# Altium schematic sheet BFMC_PowerDiagram.SchDoc
size A; SheetNumber: 1; SheetTotal: 8
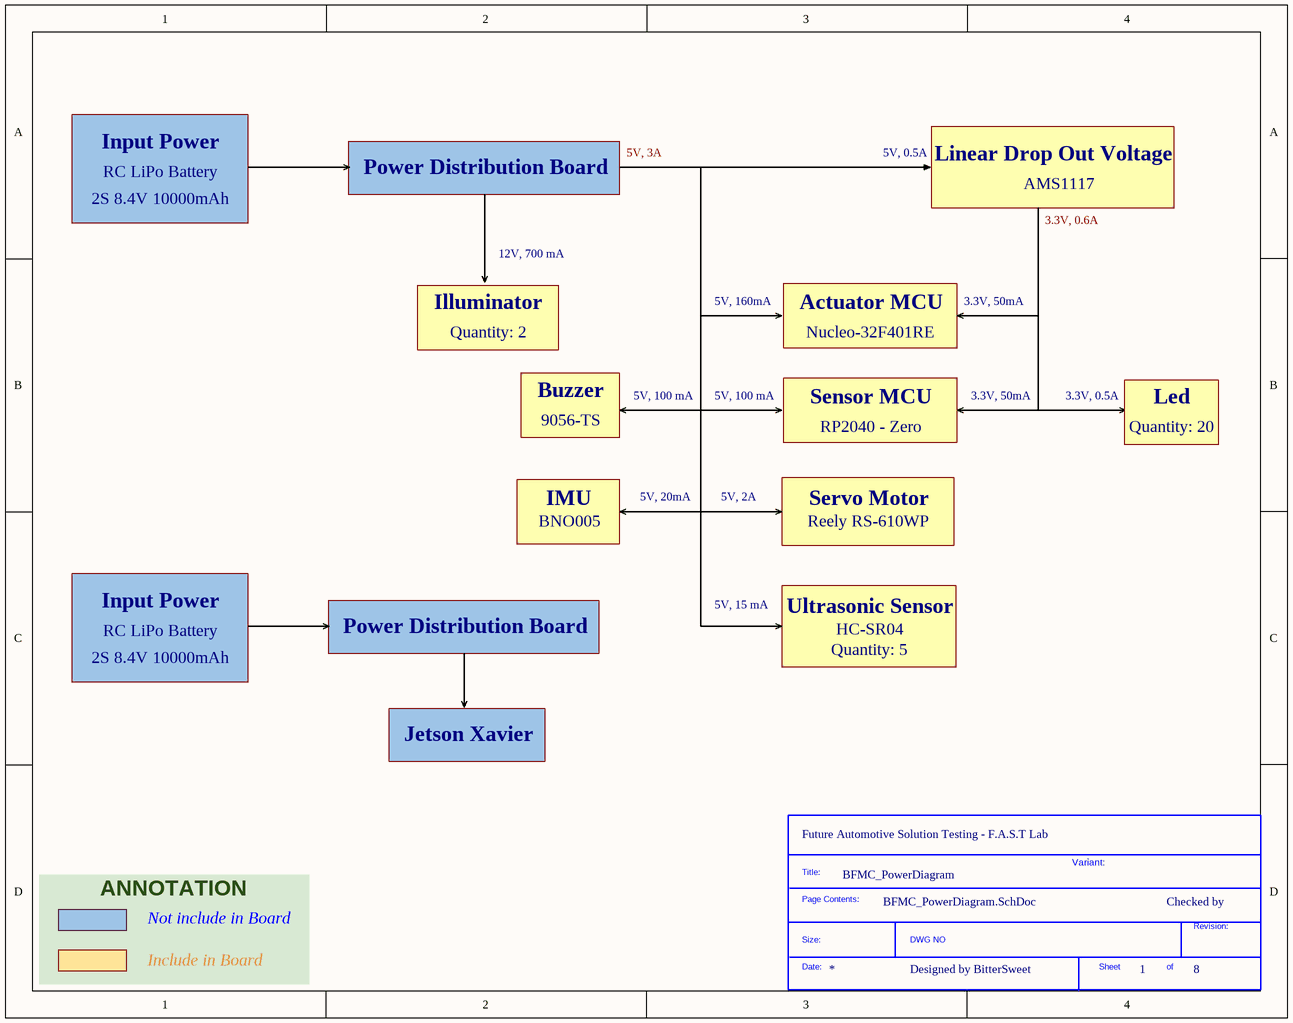
[diagram p0: BFMC_PowerDiagram.SchDoc]

## Parts
*?  SDTitleBlock  (value not drawn)  (graphical)

## Notes on the sheet
- Input Power
- 5V, 3A
- 5V, 0.5A
- Linear Drop Out Voltage
- 2S 8.4V 10000mAh
- RC LiPo Battery
- Power Distribution Board
- AMS1117
- 3.3V, 0.6A
- 12V, 700 mA
- Illuminator
- Quantity: 2
- 5V, 160mA
- Actuator MCU
- Nucleo-32F401RE
- 3.3V, 50mA
- Buzzer
- 9056-TS
- 5V, 100 mA
- Sensor MCU
- RP2040 - Zero
- 3.3V, 0.5A
- Quantity: 20
- Led
- IMU
- 5V, 20mA
- 5V, 2A
- Servo Motor
- BNO005
- Reely RS-610WP
- 5V, 15 mA
- Ultrasonic Sensor
- HC-SR04
- Quantity: 5
- Jetson Xavier
- (near *?) Future Automotive Solution Testing - F.A.S.T Lab
- BFMC_PowerDiagram
- Variant:
- Checked by
- Not include in Board
- Include in Board
- Designed by BitterSweet
- ANNOTATION
- (in symbol SDTitleBlock) Title:; Page Contents:; Revision:; Size:; DWG NO; Date:; Sheet; of